# EAGLE design ledlights (EAGLE 8.2.0)
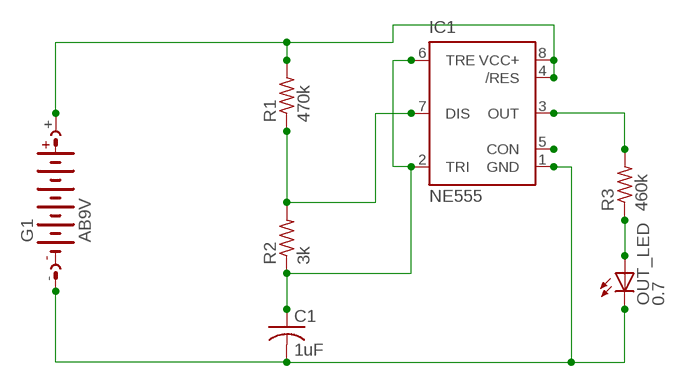
[diagram p0: schematic, sheet 1]

## Parts
C1  1uF  C-USC0805  [C0805]
G1  AB9V  [AB9V]
IC1  NE555  [DIL-08]
OUT_LED  0.7  LEDCHIP-LED0805  [CHIP-LED0805]
R1  470k  R-US_R0805  [R0805]
R2  3k  R-US_R0805  [R0805]
R3  460k  R-US_R0805  [R0805]

## Nets
N$1: G1.+ IC1.4(/RES) IC1.8(VCC+) R1.2
N$4: IC1.7(DIS) R1.1 R2.2
N$6: C1.1 IC1.2(TRI) IC1.6(TRE) R2.1
N$15: IC1.5(CON)
N$16: C1.2 G1.- IC1.1(GND) OUT_LED.C
N$17: IC1.3(OUT) R3.2
N$18: OUT_LED.A R3.1

## Library data of the parts
C1 = resistor:C-US: CAPACITOR, American symbol
G1 = battery:AB9V: 9-V BATTERY CLIP
IC1 = st-microelectronics:NE555: General purpose bipolar Timer; MF: Arrow Electronics; MPN: NE555N; OC_FARNELL: 1467742; OC_NEWARK: 89K1486
OUT_LED = led:LED: LED OSRAM: - CHIPLED LG R971, LG N971, LY N971, LG Q971, LY Q971, LO R971, LY R971 LH N974, LH R974 LS Q976, LO Q976, LY Q976 LO Q996 - Hyper CHIPLED LW Q18S LB Q993, LB Q99A, LB R99A - SideLED LS A670, LO A670, LY A670, LG A670, LP A670 LB A673, LV A673, LT A673, LW A673 LH A674 LY A675 LS A676, LA A676, LO A676, LY A676, LW A676 LS A679, LY A679, LG A679 - Hyper Micro SIDELED® LS Y876, LA Y876, LO Y876, LY Y876 LT Y87S - SmartLED LW L88C, LW L88S LB L89C, LB L89S, LG L890 LS L89K, LO L89K, LY L89K LS L896, LA L896, LO L896, LY L896 - TOPLED LS T670, LO T670, LY T670, LG T670, LP T670 LSG T670, LSP T670, LSY T670, LOP T670, LYG T670 LG T671, LOG T671, LSG T671 LB T673, LV T673, LT T673, LW T673 LH T674 LS T676, LA T676, LO T676, LY T676, LB T676, LH T676, LSB T676, LW T676 LB T67C, LV T67C, LT T67C, LS T67K, LO T67K, LY T67K, LW E67C LS E67B, LA E67B, LO E67B, LY E67B, LB E67C, LV E67C, LT E67C LW T67C LS T679, LY T679, LG T679 LS T770, LO T770, LY T770, LG T770, LP T770 LB T773, LV T773, LT T773, LW T773 LH T774 LS E675, LA E675, LY E675, LS T675 LS T776, LA T776, LO T776, LY T776, LB T776 LHGB T686 LT T68C, LB T68C - Hyper Mini TOPLED® LB M676 - Mini TOPLED Santana® LG M470 LS M47K, LO M47K, LY M47K Source: http://www.osram.convergy.de LUXEON: - LUMILED® LXK2-PW12-R00, LXK2-PW12-S00, LXK2-PW14-U00, LXK2-PW14-V00 LXK2-PM12-R00, LXK2-PM12-S00, LXK2-PM14-U00 LXK2-PE12-Q00, LXK2-PE12-R00, LXK2-PE12-S00, LXK2-PE14-T00, LXK2-PE14-U00 LXK2-PB12-K00, LXK2-PB12-L00, LXK2-PB12-M00, LXK2-PB14-N00, LXK2-PB14-P00, LXK2-PB14-Q00 LXK2-PR12-L00, LXK2-PR12-M00, LXK2-PR14-Q00, LXK2-PR14-R00 LXK2-PD12-Q00, LXK2-PD12-R00, LXK2-PD12-S00 LXK2-PH12-R00, LXK2-PH12-S00 LXK2-PL12-P00, LXK2-PL12-Q00, LXK2-PL12-R00 Source: www.luxeon.com KINGBRIGHT: KA-3528ASYC Source: www.kingbright.com
R1-R3 = resistor:R-US_: RESISTOR, American symbol

## Board
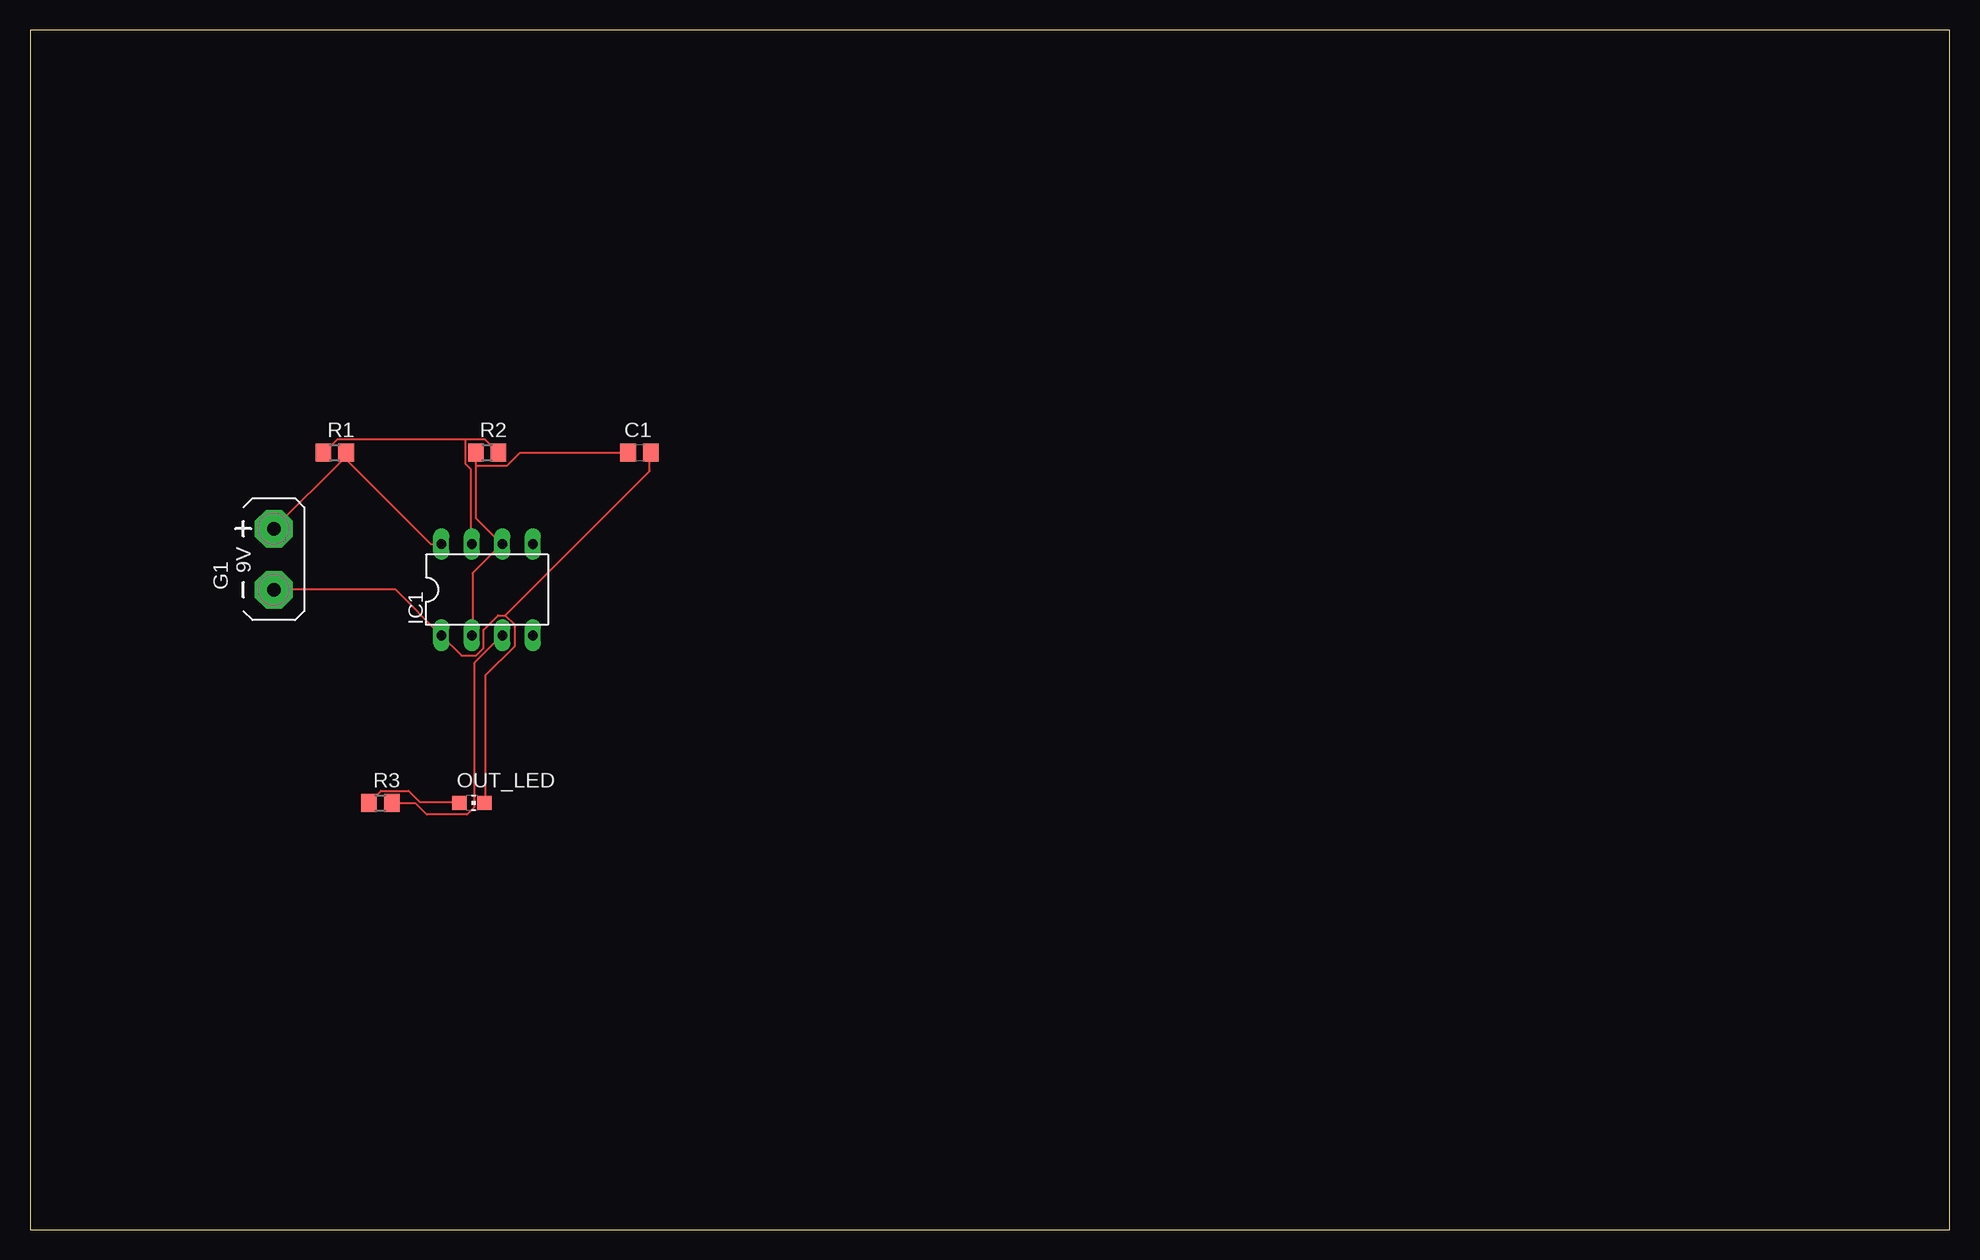
[diagram p1: board, top side]
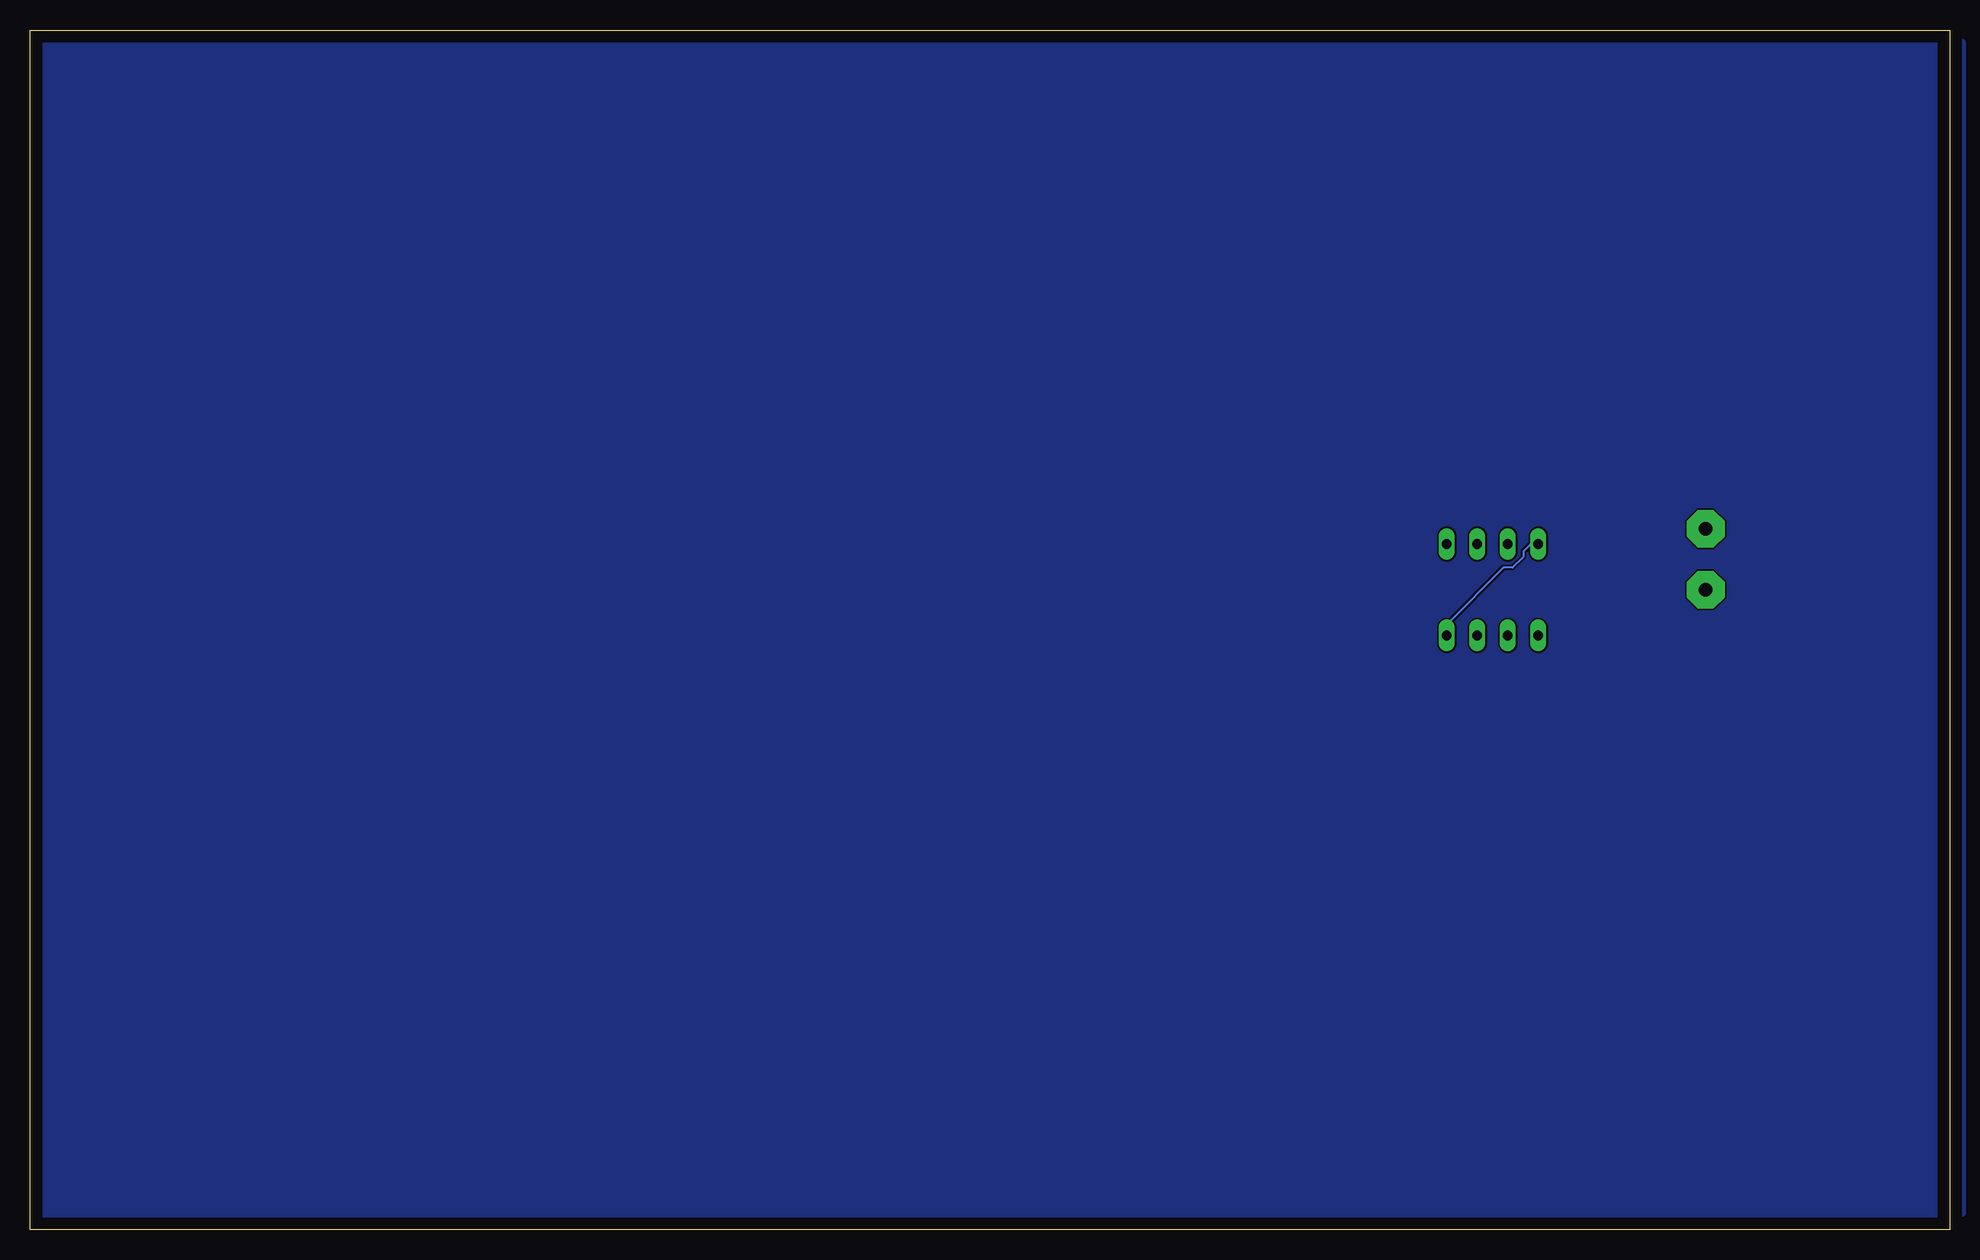
[diagram p2: board, bottom side, seen from below]

Size 160 x 100 mm. Coordinates in mm from the lower left corner, seen from the top.
Outline: 0,0 160,0 160,100 0,100 0,0
Copper layers (1*16): Top 0.035mm / dielectric 1.5mm / Bottom 0.035mm
Design rules "default": minimum track width 6mil, minimum drill 0.35mm, track to track 6mil, track to pad 6mil, pad to pad 6mil, via to via 6mil, smd to smd 6mil, copper to edge 40mil, drill to drill 6mil, minimum pad ring 10mil, minimum via ring 8mil, stop-mask expansion 4mil, vias tented up to drill 0mil, thermal gap 10mil

### Footprints (pad centres in the part's own frame; a part is rotated, then mirrored left to right if it is on the bottom)
C0805 = smd 1.3 x 1.5: 1 -0.95,0; 2 0.95,0
AB9V = drill 1.118 pad 3.15 octagon: + 0,2.54; - 0,-2.54
DIL-08 = drill 0.813 long: 1 -3.81,-3.81; 2 -1.27,-3.81; 3 1.27,-3.81; 4 3.81,-3.81; 5 3.81,3.81; 6 1.27,3.81; 7 -1.27,3.81; 8 -3.81,3.81
CHIP-LED0805 = smd 1.2 x 1.2: A 0,-1.05; C 0,1.05
R0805 = smd 1.3 x 1.5: 1 -0.95,0; 2 0.95,0

### Placement (x,y rotation side)
C1  50.8,64.77 0 top
G1  20.32,55.88 0 top
IC1  38.1,53.34 0 top
OUT_LED  36.83,35.56 270 top
R1  25.4,64.77 0 top
R2  38.1,64.77 0 top
R3  [R0805]  29.21,35.56 0 top

### Tracks (layer width: path | path; a pad name or v marks a point on that pad's centre or on a via)
N$1
  Top 0.152: 26.21,64.31 26.21,64.77 R1.2 26.21,64.31 | 26.21,64.31 G1.+ | IC1.8 33.38,57.15 26.21,64.31
  Bottom 0.152: IC1.4 41.91,50.44 37.19,55.17 36.42,55.17 35.51,56.08 35.51,56.54 34.9,57.15 IC1.8
N$2
  pour Bottom: 0,0 160.02,0 160.02,100.33 0,100.33 -1.27,99.06 -1.27,1.27
N$4
  Top 0.152: 36.27,65.84 37.95,65.84 39.01,64.77 R2.2 | 36.27,65.84 25.6,65.84 24.54,64.77 R1.1 | 36.27,65.84 36.27,63.86 36.73,63.4 36.73,57.15 IC1.7
N$6
  Top 0.152: 37.19,63.7 37.19,59.28 39.32,57.15 | 37.19,63.7 37.19,64.77 R2.1 | C1.1 40.84,64.77 39.78,63.7 37.19,63.7 | 39.32,57.15 36.88,54.71 36.88,49.53 IC1.2 | 39.32,57.15 IC1.6
N$16
  Top 0.152: 39.62,51.21 40.39,50.44 40.39,48.62 37.95,46.18 37.95,35.66 OUT_LED.C | 39.62,51.21 39.01,51.21 37.8,49.99 37.8,48.46 37.19,47.85 35.97,47.85 IC1.1 30.48,53.34 G1.- | 39.62,51.21 51.66,63.25 51.66,64.77 C1.2
N$17
  Top 0.152: R3.2 30.18,35.51 32.16,35.51 33.07,34.59 36.42,34.59 37.03,35.2 37.03,47.24 39.32,49.53 IC1.3
N$18
  Top 0.152: OUT_LED.A 35.66,35.66 32.46,35.66 31.55,36.58 29.26,36.58 28.35,35.66 R3.1